# Altium schematic sheet ad.SchDoc
size A1
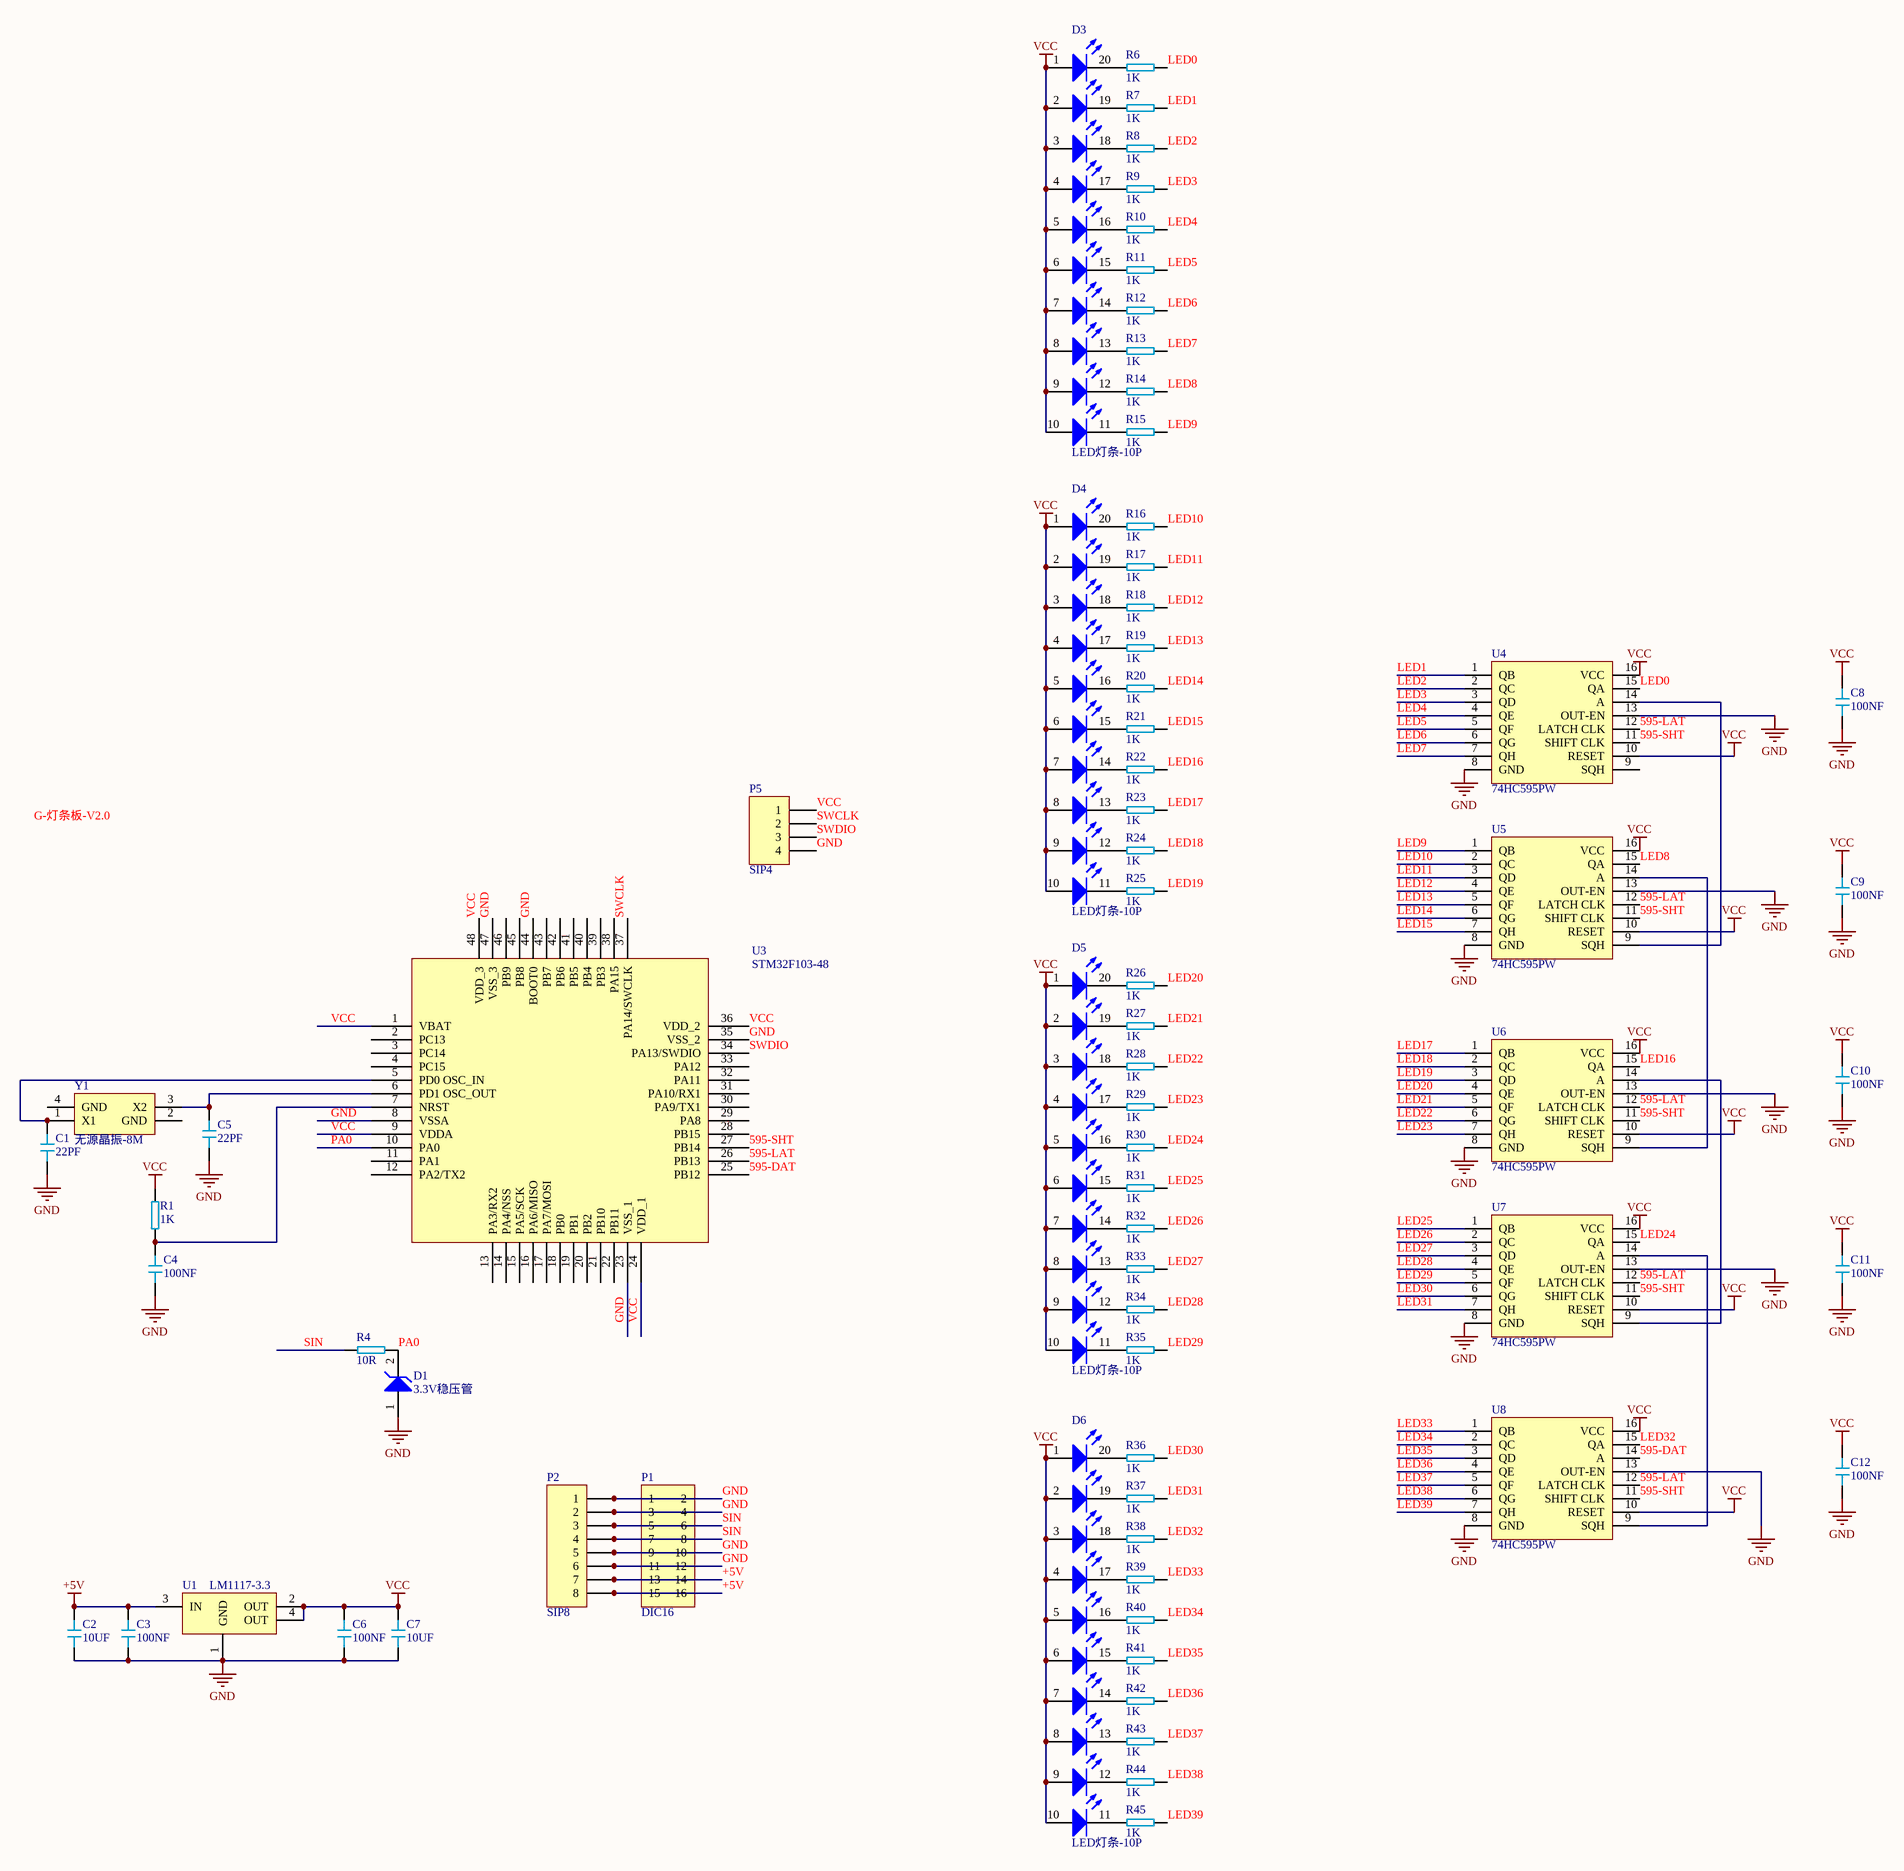
[diagram p0: ad.SchDoc]

## Parts
C1  22PF  [C0603]
C2  10UF  [C0603]
C3  100NF  [C0603]
C4  100NF  [C0603]
C5  22PF  [C0603]
C6  100NF  [C0603]
C7  10UF  [C0603]
C8  100NF  [C0603]
C9  100NF  [C0603]
C10  100NF  [C0603]
C11  100NF  [C0603]
C12  100NF  [C0603]
D1  3.3V稳压管  [D1206]
D3  LED灯条-10P  [LED-10]
D4  LED灯条-10P  [LED-10]
D5  LED灯条-10P  [LED-10]
D6  LED灯条-10P  [LED-10]
P1  DIC16  [141V-8P]
P2  SIP8  [SIP8]
P5  SIP4  [SIP4]
R1  1K  [R0603]
R4  10R  [R0603]
R6  1K  [R0603]
R7  1K  [R0603]
R8  1K  [R0603]
R9  1K  [R0603]
R10  1K  [R0603]
R11  1K  [R0603]
R12  1K  [R0603]
R13  1K  [R0603]
R14  1K  [R0603]
R15  1K  [R0603]
R16  1K  [R0603]
R17  1K  [R0603]
R18  1K  [R0603]
R19  1K  [R0603]
R20  1K  [R0603]
R21  1K  [R0603]
R22  1K  [R0603]
R23  1K  [R0603]
R24  1K  [R0603]
R25  1K  [R0603]
R26  1K  [R0603]
R27  1K  [R0603]
R28  1K  [R0603]
R29  1K  [R0603]
R30  1K  [R0603]
R31  1K  [R0603]
R32  1K  [R0603]
R33  1K  [R0603]
R34  1K  [R0603]
R35  1K  [R0603]
R36  1K  [R0603]
R37  1K  [R0603]
R38  1K  [R0603]
R39  1K  [R0603]
R40  1K  [R0603]
R41  1K  [R0603]
R42  1K  [R0603]
R43  1K  [R0603]
R44  1K  [R0603]
R45  1K  [R0603]
U1  LM1117-3.3  [SOT223]
U3  STM32F103-48  [LQFP48]
U4  74HC595PW  [TSSOP16]
U5  74HC595PW  [TSSOP16]
U6  74HC595PW  [TSSOP16]
U7  74HC595PW  [TSSOP16]
U8  74HC595PW  [TSSOP16]
Y1  无源晶振-8M  [XTAL-3225-4]

## Nets
+5V: C2.2 C3.2 P1.13 P1.14 P1.15 P1.16 P2.7 P2.8 U1.3(IN)
GND: C1.1 C2.1 C3.1 C4.1 C5.1 C6.1 C7.1 C8.1 C9.1 C10.1 C11.1 C12.1 D1.1 P1.1 P1.2 P1.3 P1.4 P1.9 P1.10 P1.11 P1.12 P2.1 P2.2 P2.5 P2.6 P5.4 U1.1(GND) U3.8(VSSA) U3.23(VSS_1) U3.35(VSS_2) U3.44(BOOT0) U3.47(VSS_3) U4.8(GND) U4.13(OUT-EN) U5.8(GND) U5.13(OUT-EN) U6.8(GND) U6.13(OUT-EN) U7.8(GND) U7.13(OUT-EN) U8.8(GND) U8.13(OUT-EN)
VCC: C6.2 C7.2 C8.2 C9.2 C10.2 C11.2 C12.2 D3.1(A) D3.2(A) D3.3(A) D3.4(A) D3.5(A) D3.6(A) D3.7(A) D3.8(A) D3.9(A) D3.10(A) D4.1(A) D4.2(A) D4.3(A) D4.4(A) D4.5(A) D4.6(A) D4.7(A) D4.8(A) D4.9(A) D4.10(A) D5.1(A) D5.2(A) D5.3(A) D5.4(A) D5.5(A) D5.6(A) D5.7(A) D5.8(A) D5.9(A) D5.10(A) D6.1(A) D6.2(A) D6.3(A) D6.4(A) D6.5(A) D6.6(A) D6.7(A) D6.8(A) D6.9(A) D6.10(A) P5.1 R1.2 U1.2(OUT) U1.4(OUT) U3.1(VBAT) U3.9(VDDA) U3.24(VDD_1) U3.36(VDD_2) U3.48(VDD_3) U4.10(RESET) U4.16(VCC) U5.10(RESET) U5.16(VCC) U6.10(RESET) U6.16(VCC) U7.10(RESET) U7.16(VCC) U8.10(RESET) U8.16(VCC)
595-DAT: U3.25(PB12) U8.14(A)
595-LAT: U3.26(PB13) U4.12(LATCH_CLK) U5.12(LATCH_CLK) U6.12(LATCH_CLK) U7.12(LATCH_CLK) U8.12(LATCH_CLK)
595-SHT: U3.27(PB14) U4.11(SHIFT_CLK) U5.11(SHIFT_CLK) U6.11(SHIFT_CLK) U7.11(SHIFT_CLK) U8.11(SHIFT_CLK)
LED0: R6.1 U4.15(QA)
LED1: R7.1 U4.1(QB)
LED2: R8.1 U4.2(QC)
LED3: R9.1 U4.3(QD)
LED4: R10.1 U4.4(QE)
LED5: R11.1 U4.5(QF)
LED6: R12.1 U4.6(QG)
LED7: R13.1 U4.7(QH)
LED8: R14.1 U5.15(QA)
LED9: R15.1 U5.1(QB)
LED10: R16.1 U5.2(QC)
LED11: R17.1 U5.3(QD)
LED12: R18.1 U5.4(QE)
LED13: R19.1 U5.5(QF)
LED14: R20.1 U5.6(QG)
LED15: R21.1 U5.7(QH)
LED16: R22.1 U6.15(QA)
LED17: R23.1 U6.1(QB)
LED18: R24.1 U6.2(QC)
LED19: R25.1 U6.3(QD)
LED20: R26.1 U6.4(QE)
LED21: R27.1 U6.5(QF)
LED22: R28.1 U6.6(QG)
LED23: R29.1 U6.7(QH)
LED24: R30.1 U7.15(QA)
LED25: R31.1 U7.1(QB)
LED26: R32.1 U7.2(QC)
LED27: R33.1 U7.3(QD)
LED28: R34.1 U7.4(QE)
LED29: R35.1 U7.5(QF)
LED30: R36.1 U7.6(QG)
LED31: R37.1 U7.7(QH)
LED32: R38.1 U8.15(QA)
LED33: R39.1 U8.1(QB)
LED34: R40.1 U8.2(QC)
LED35: R41.1 U8.3(QD)
LED36: R42.1 U8.4(QE)
LED37: R43.1 U8.5(QF)
LED38: R44.1 U8.6(QG)
LED39: R45.1 U8.7(QH)
PA0: D1.2 R4.2 U3.10(PA0)
SIN: P1.5 P1.6 P1.7 P1.8 P2.3 P2.4 R4.1
SWCLK: P5.2 U3.37(PA14/SWCLK)
SWDIO: P5.3 U3.34(PA13/SWDIO)
NetC1_2: C1.2 U3.5(PD0_OSC_IN) Y1.1(X1)
NetC4_2: C4.2 R1.1 U3.7(NRST)
NetC5_2: C5.2 U3.6(PD1_OSC_OUT) Y1.3(X2)
NetD3_11: D3.11(K) R15.2
NetD3_12: D3.12(K) R14.2
NetD3_13: D3.13(K) R13.2
NetD3_14: D3.14(K) R12.2
NetD3_15: D3.15(K) R11.2
NetD3_16: D3.16(K) R10.2
NetD3_17: D3.17(K) R9.2
NetD3_18: D3.18(K) R8.2
NetD3_19: D3.19(K) R7.2
NetD3_20: D3.20(K) R6.2
NetD4_11: D4.11(K) R25.2
NetD4_12: D4.12(K) R24.2
NetD4_13: D4.13(K) R23.2
NetD4_14: D4.14(K) R22.2
NetD4_15: D4.15(K) R21.2
NetD4_16: D4.16(K) R20.2
NetD4_17: D4.17(K) R19.2
NetD4_18: D4.18(K) R18.2
NetD4_19: D4.19(K) R17.2
NetD4_20: D4.20(K) R16.2
NetD5_11: D5.11(K) R35.2
NetD5_12: D5.12(K) R34.2
NetD5_13: D5.13(K) R33.2
NetD5_14: D5.14(K) R32.2
NetD5_15: D5.15(K) R31.2
NetD5_16: D5.16(K) R30.2
NetD5_17: D5.17(K) R29.2
NetD5_18: D5.18(K) R28.2
NetD5_19: D5.19(K) R27.2
NetD5_20: D5.20(K) R26.2
NetD6_11: D6.11(K) R45.2
NetD6_12: D6.12(K) R44.2
NetD6_13: D6.13(K) R43.2
NetD6_14: D6.14(K) R42.2
NetD6_15: D6.15(K) R41.2
NetD6_16: D6.16(K) R40.2
NetD6_17: D6.17(K) R39.2
NetD6_18: D6.18(K) R38.2
NetD6_19: D6.19(K) R37.2
NetD6_20: D6.20(K) R36.2
NetU4_14: U4.14(A) U5.9(SQH)
NetU5_14: U5.14(A) U6.9(SQH)
NetU6_14: U6.14(A) U7.9(SQH)
NetU7_14: U7.14(A) U8.9(SQH)

Not connected (* = marked no-connect by the designer): U3 2(PC13) 3(PC14) 4(PC15) 11(PA1) 12(PA2/TX2) 13(PA3/RX2) 14(PA4/NSS) 15(PA5/SCK) 16(PA6/MISO) 17(PA7/MOSI) 18(PB0) 19(PB1) 20(PB2) 21(PB10) 22(PB11) 28(PB15) 29(PA8) 30(PA9/TX1) 31(PA10/RX1) 32(PA11) 33(PA12) 38(PA15) 39(PB3) 40(PB4) 41(PB5) 42(PB6) 43(PB7) 45(PB8) 46(PB9); U4 9(SQH); Y1 2(GND) 4(GND)

## Notes on the sheet
- Labels drawn without touching a wire or pin: G-灯条板-V2.0

## Library data of the parts
C1-C12 = C0603: 贴片电容
D1 = TVS-SMA: 稳压管; Published: 8-Jun-2000; LatestRevisionDate: 17-Jul-2002; LatestRevisionNote: Re-released for DXP Platform.; DatasheetVersion: 1997; PackageReference: DO-35; Publisher: Altium Limited; PackageDescription: Diode, Axial; Body 3.8 x 1.9 mm (LxDia. max), Lead Dia. 0.53 mm (max); Code_JEDEC: DO-204-AH; ComponentLink1Description: Manufacturer Link; ComponentLink1URL: http://www.fairchildsemi.com/; ComponentLink2Description: Datasheet; ComponentLink2URL: http://www.fairchildsemi.com/ds/1N%2F1N4448.pdf
D3-D6 = LED-10: LED灯条
P1 = DIC16: 连接器; LatestRevisionDate: 17-Jul-2002; LatestRevisionNote: Re-released for DXP Platform.; Publisher: Altium Limited
P2 = SIP8: 连接器; LatestRevisionDate: 17-Jul-2002; LatestRevisionNote: Re-released for DXP Platform.; Publisher: Altium Limited
P5 = SIP4: 连接器; LatestRevisionDate: 17-Jul-2002; LatestRevisionNote: Re-released for DXP Platform.; Publisher: Altium Limited
R1 R4 R6-R45 = R-0603: 贴片电阻
U1 = 1117: 芯片; LatestRevisionDate: 17-Jul-2002; LatestRevisionNote: Re-released for DXP Platform.; Publisher: Altium Limited
U4-U8 = 74HC595: 芯片
Y1 = XTAL-4-W: Published: 8-Jun-2000; LatestRevisionDate: 17-Jul-2002; LatestRevisionNote: Re-released for DXP Platform.; PackageReference: R38; Publisher: Altium Limited; PackageDescription: Crystal, Thru-Hole; 2 Leads; Body 3.1 x 8.2 mm (Dia.xH)